# Altium schematic sheet Top.SchDoc: **
size A4; Author: **; CompanyName: Introducción al Diseño de Circuitos Impresos; Organization: UTN FRBA; Revision: **
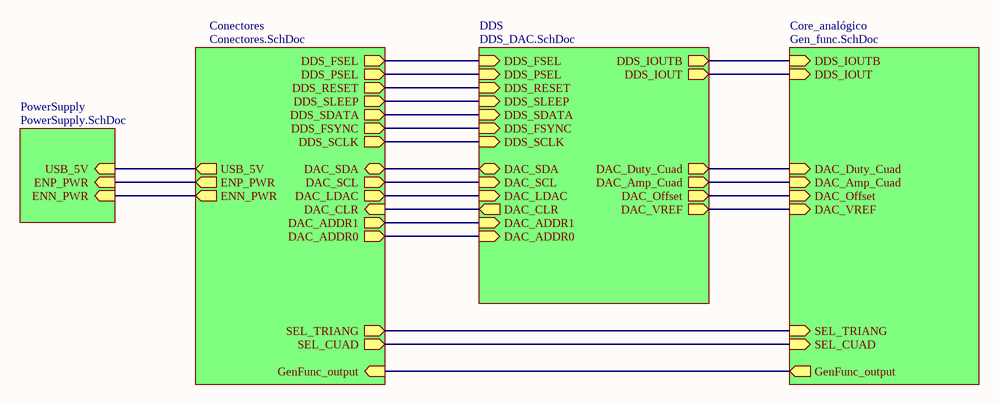
[diagram p0: Top.SchDoc]

## Sub-sheets
Conectores = Conectores.SchDoc: DAC_SDA (bidir), DAC_SCL (out), DAC_LDAC (out), DAC_CLR (in), SEL_CUAD (out), GenFunc_output (in), DDS_FSEL (out), DDS_PSEL (out), DDS_RESET (out), DDS_SLEEP (out), DDS_FSYNC (out), DDS_SDATA (out), DDS_SCLK (out), USB_5V (out), SEL_TRIANG (out), ENN_PWR (out), ENP_PWR (out), DAC_ADDR1 (out), DAC_ADDR0 (out)
Core_analógico = Gen_func.SchDoc: DDS_IOUT (in), DDS_IOUTB (in), DAC_Amp_Cuad (in), SEL_CUAD (in), GenFunc_output (out), DAC_Duty_Cuad (in), SEL_TRIANG (in), DAC_Offset (in), DAC_VREF (in)
DDS = DDS_DAC.SchDoc: DDS_FSEL (in), DDS_PSEL (in), DDS_RESET (in), DDS_SLEEP (in), DDS_SDATA (in), DDS_SCLK (in), DDS_IOUTB (out), DDS_IOUT (out), DDS_FSYNC (in), DAC_SDA (bidir), DAC_SCL (in), DAC_LDAC (in), DAC_CLR (out), DAC_Amp_Cuad (out), DAC_Duty_Cuad (out), DAC_Offset (out), DAC_ADDR0 (in), DAC_ADDR1 (in), DAC_VREF (out)
PowerSupply = PowerSupply.SchDoc: USB_5V (in), ENP_PWR (in), ENN_PWR (in)

## Nets
(unnamed): sheet Conectores/DAC_SDA, sheet DDS/DAC_SDA
(unnamed): sheet Conectores/DAC_SCL, sheet DDS/DAC_SCL
(unnamed): sheet Conectores/DAC_LDAC, sheet DDS/DAC_LDAC
(unnamed): sheet Conectores/DAC_CLR, sheet DDS/DAC_CLR
(unnamed): sheet Conectores/SEL_CUAD, sheet Core_analógico/SEL_CUAD
(unnamed): sheet Conectores/GenFunc_output, sheet Core_analógico/GenFunc_output
(unnamed): sheet Conectores/DDS_FSEL, sheet DDS/DDS_FSEL
(unnamed): sheet Conectores/DDS_PSEL, sheet DDS/DDS_PSEL
(unnamed): sheet Conectores/DDS_RESET, sheet DDS/DDS_RESET
(unnamed): sheet Conectores/DDS_SLEEP, sheet DDS/DDS_SLEEP
(unnamed): sheet Conectores/DDS_FSYNC, sheet DDS/DDS_FSYNC
(unnamed): sheet Conectores/DDS_SDATA, sheet DDS/DDS_SDATA
(unnamed): sheet Conectores/DDS_SCLK, sheet DDS/DDS_SCLK
(unnamed): sheet Conectores/USB_5V, sheet PowerSupply/USB_5V
(unnamed): sheet Conectores/SEL_TRIANG, sheet Core_analógico/SEL_TRIANG
(unnamed): sheet Conectores/ENN_PWR, sheet PowerSupply/ENN_PWR
(unnamed): sheet Conectores/ENP_PWR, sheet PowerSupply/ENP_PWR
(unnamed): sheet Conectores/DAC_ADDR1, sheet DDS/DAC_ADDR1
(unnamed): sheet Conectores/DAC_ADDR0, sheet DDS/DAC_ADDR0
(unnamed): sheet DDS/DDS_IOUTB, sheet Core_analógico/DDS_IOUTB
(unnamed): sheet DDS/DDS_IOUT, sheet Core_analógico/DDS_IOUT
(unnamed): sheet DDS/DAC_Amp_Cuad, sheet Core_analógico/DAC_Amp_Cuad
(unnamed): sheet DDS/DAC_Duty_Cuad, sheet Core_analógico/DAC_Duty_Cuad
(unnamed): sheet DDS/DAC_Offset, sheet Core_analógico/DAC_Offset
(unnamed): sheet DDS/DAC_VREF, sheet Core_analógico/DAC_VREF

## Notes on the sheet
- Title:
- Size:
- Author:
- A4
- Sheet
- of
- Revision:
- File:
- Date: